# EAGLE design woodenHaptics_v_0_1 (EAGLE 6.5.0)
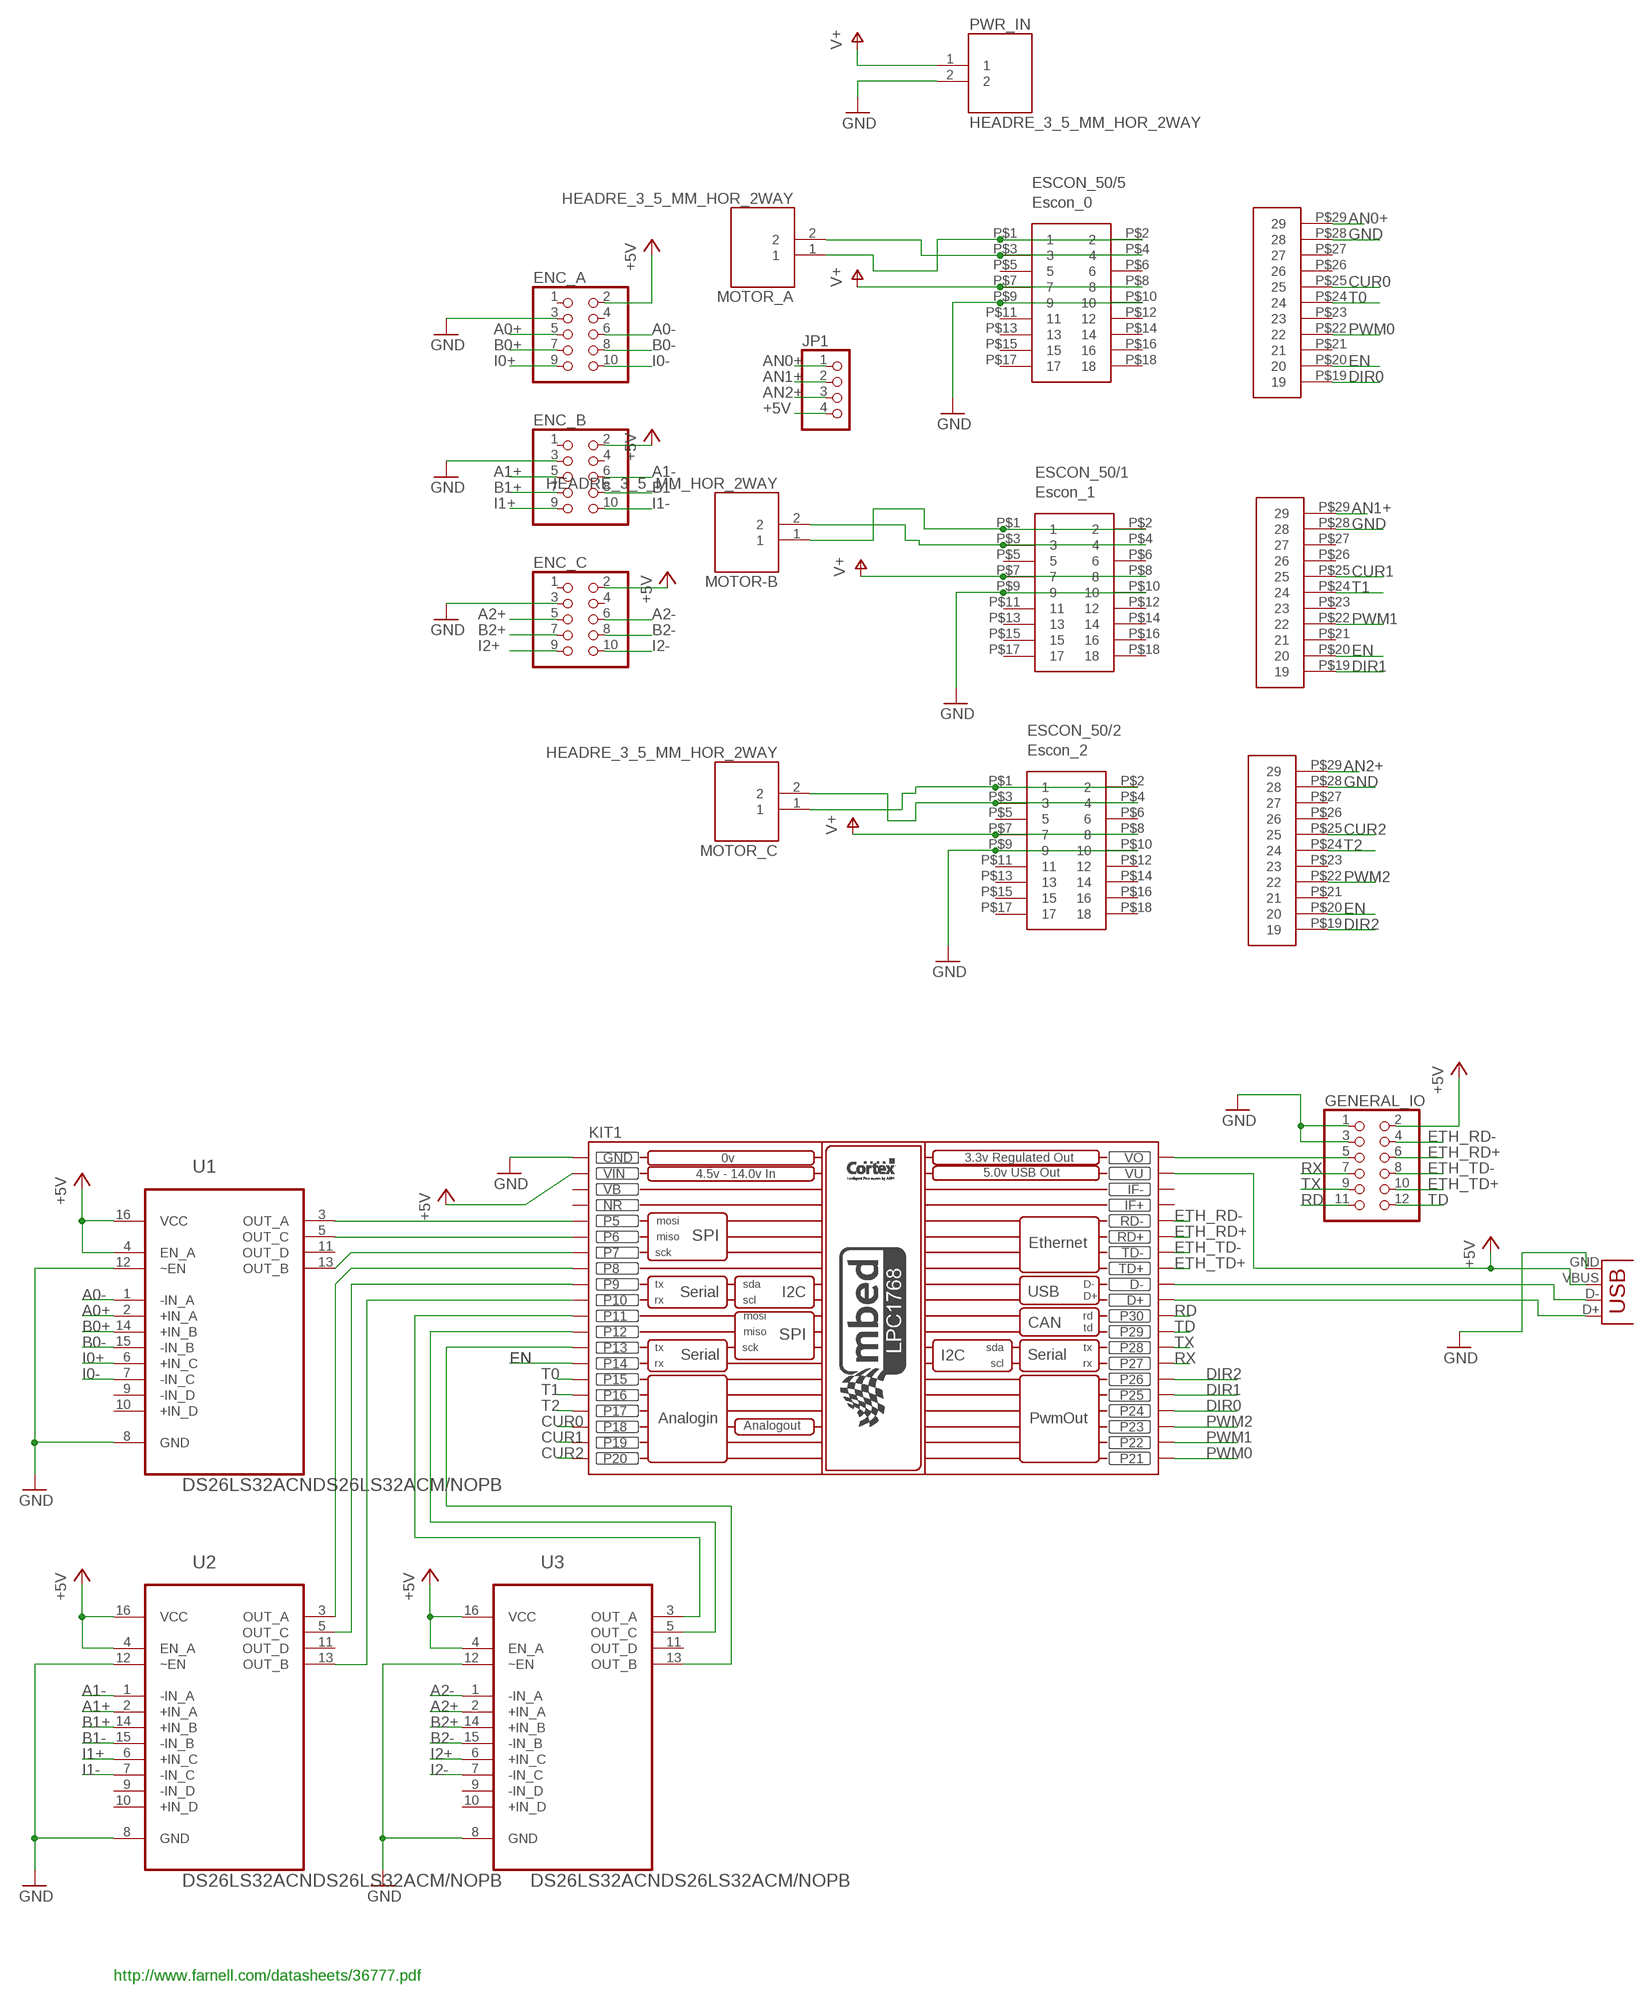
[diagram p0: schematic, sheet 1]

## Parts
ENC_A  PINHD-2X5  [2X05]
ENC_B  PINHD-2X5  [2X05]
ENC_C  PINHD-2X5  [2X05]
ESCON_50/1  Escon_1  ESCON_MODULE_50/5  [MODULE]
ESCON_50/2  Escon_2  ESCON_MODULE_50/5  [MODULE]
ESCON_50/5  Escon_0  ESCON_MODULE_50/5  [MODULE]
GENERAL_IO  PINHD-2X6  [2X06]
JP1  PINHD-1X4  [1X04]
KIT1  MBED_NXP_LPC1768  [MBED-KIT]
MOTOR-B  HEADRE_3_5_MM_HOR_2WAY  [HEADER_3_5MM_HOR_2WAY]
MOTOR_A  HEADRE_3_5_MM_HOR_2WAY  [HEADER_3_5MM_HOR_2WAY]
MOTOR_C  HEADRE_3_5_MM_HOR_2WAY  [HEADER_3_5MM_HOR_2WAY]
PWR_IN  HEADRE_3_5_MM_HOR_2WAY  [HEADER_3_5MM_HOR_2WAY]
U1  DS26LS32ACNDS26LS32ACM/NOPB  [M16]
U2  DS26LS32ACNDS26LS32ACM/NOPB  [M16]
U3  DS26LS32ACNDS26LS32ACM/NOPB  [M16]
X2  Micro USB  USB-MICROB  [USB-MICROB]

## Nets
+5V: ENC_A.2 ENC_B.2 ENC_C.2 GENERAL_IO.2 JP1.4 KIT1.VIN KIT1.VU U1.4(EN_A) U1.16(VCC) U2.4(EN_A) U2.16(VCC) U3.4(EN_A) U3.16(VCC) X2.VBUS
A0+: ENC_A.5 U1.2(+IN_A)
A0-: ENC_A.6 U1.1(-IN_A)
A1+: ENC_B.5 U2.2(+IN_A)
A1-: ENC_B.6 U2.1(-IN_A)
A2+: ENC_C.5 U3.2(+IN_A)
A2-: ENC_C.6 U3.1(-IN_A)
AN0+: ESCON_50/5.P$29 JP1.1
AN1+: ESCON_50/1.P$29 JP1.2
AN2+: ESCON_50/2.P$29 JP1.3
B0+: ENC_A.7 U1.14(+IN_B)
B0-: ENC_A.8 U1.15(-IN_B)
B1+: ENC_B.7 U2.14(+IN_B)
B1-: ENC_B.8 U2.15(-IN_B)
B2+: ENC_C.7 U3.14(+IN_B)
B2-: ENC_C.8 U3.15(-IN_B)
CUR0: ESCON_50/5.P$25 KIT1.P$18(P18)
CUR1: ESCON_50/1.P$25 KIT1.P$19(P19)
CUR2: ESCON_50/2.P$25 KIT1.P$20(P20)
DIR0: ESCON_50/5.P$19 KIT1.P$24(P24)
DIR1: ESCON_50/1.P$19 KIT1.P$25(P25)
DIR2: ESCON_50/2.P$19 KIT1.P$26(P26)
EN: ESCON_50/1.P$20 ESCON_50/2.P$20 ESCON_50/5.P$20 KIT1.P$14(P14)
ETH_RD+: GENERAL_IO.6 KIT1.RD+
ETH_RD-: GENERAL_IO.4 KIT1.RD-
ETH_TD+: GENERAL_IO.10 KIT1.TD+
ETH_TD-: GENERAL_IO.8 KIT1.TD-
GND: ENC_A.3 ENC_B.3 ENC_C.3 ESCON_50/1.P$9 ESCON_50/1.P$10 ESCON_50/1.P$28 ESCON_50/2.P$9 ESCON_50/2.P$10 ESCON_50/2.P$28 ESCON_50/5.P$9 ESCON_50/5.P$10 ESCON_50/5.P$28 GENERAL_IO.1 GENERAL_IO.3 KIT1.GND PWR_IN.2 U1.8(GND) U1.12(~EN) U2.8(GND) U2.12(~EN) U3.8(GND) U3.12(~EN) X2.GND
I0+: ENC_A.9 U1.6(+IN_C)
I0-: ENC_A.10 U1.7(-IN_C)
I1+: ENC_B.9 U2.6(+IN_C)
I1-: ENC_B.10 U2.7(-IN_C)
I2+: ENC_C.9 U3.6(+IN_C)
I2-: ENC_C.10 U3.7(-IN_C)
N$1: ESCON_50/5.P$3 ESCON_50/5.P$4 MOTOR_A.2
N$2: ESCON_50/1.P$1 ESCON_50/1.P$2 MOTOR-B.1
N$3: KIT1.D- X2.D-
N$4: ESCON_50/1.P$3 ESCON_50/1.P$4 MOTOR-B.2
N$5: ESCON_50/2.P$1 ESCON_50/2.P$2 MOTOR_C.1
N$6: ESCON_50/2.P$3 ESCON_50/2.P$4 MOTOR_C.2
N$7: KIT1.D+ X2.D+
N$9: KIT1.P$8(P8) U2.3(OUT_A)
N$10: GENERAL_IO.5 KIT1.VOUT(VO)
N$11: KIT1.P$5(P5) U1.3(OUT_A)
N$12: KIT1.P$6(P6) U1.5(OUT_C)
N$13: KIT1.P$7(P7) U1.13(OUT_B)
N$14: KIT1.P$9(P9) U2.5(OUT_C)
N$15: KIT1.P$10(P10) U2.13(OUT_B)
N$16: KIT1.P$11(P11) U3.3(OUT_A)
N$17: KIT1.P$12(P12) U3.5(OUT_C)
N$18: KIT1.P$13(P13) U3.13(OUT_B)
N$19: ESCON_50/5.P$1 ESCON_50/5.P$2 MOTOR_A.1
PWM0: ESCON_50/5.P$22 KIT1.P$21(P21)
PWM1: ESCON_50/1.P$22 KIT1.P$22(P22)
PWM2: ESCON_50/2.P$22 KIT1.P$23(P23)
RD: GENERAL_IO.11 KIT1.P$30(P30)
RX: GENERAL_IO.7 KIT1.P$27(P27)
T0: ESCON_50/5.P$24 KIT1.P$15(P15)
T1: ESCON_50/1.P$24 KIT1.P$16(P16)
T2: ESCON_50/2.P$24 KIT1.P$17(P17)
TD: GENERAL_IO.12 KIT1.P$29(P29)
TX: GENERAL_IO.9 KIT1.P$28(P28)
V+: ESCON_50/1.P$7 ESCON_50/1.P$8 ESCON_50/2.P$7 ESCON_50/2.P$8 ESCON_50/5.P$7 ESCON_50/5.P$8 PWR_IN.1
Unconnected: ENC_A.1 ENC_A.4 ENC_B.1 ENC_B.4 ENC_C.1 ENC_C.4 ESCON_50/1.P$5 ESCON_50/1.P$6 ESCON_50/1.P$11 ESCON_50/1.P$12 ESCON_50/1.P$13 ESCON_50/1.P$14 ESCON_50/1.P$15 ESCON_50/1.P$16 ESCON_50/1.P$17 ESCON_50/1.P$18 ESCON_50/1.P$21 ESCON_50/1.P$23 ESCON_50/1.P$26 ESCON_50/1.P$27 ESCON_50/2.P$5 ESCON_50/2.P$6 ESCON_50/2.P$11 ESCON_50/2.P$12 ESCON_50/2.P$13 ESCON_50/2.P$14 ESCON_50/2.P$15 ESCON_50/2.P$16 ESCON_50/2.P$17 ESCON_50/2.P$18 ESCON_50/2.P$21 ESCON_50/2.P$23 ESCON_50/2.P$26 ESCON_50/2.P$27 ESCON_50/5.P$5 ESCON_50/5.P$6 ESCON_50/5.P$11 ESCON_50/5.P$12 ESCON_50/5.P$13 ESCON_50/5.P$14 ESCON_50/5.P$15 ESCON_50/5.P$16 ESCON_50/5.P$17 ESCON_50/5.P$18 ESCON_50/5.P$21 ESCON_50/5.P$23 ESCON_50/5.P$26 ESCON_50/5.P$27 KIT1.IF+ KIT1.IF- U1.9(-IN_D) U1.10(+IN_D) U1.11(OUT_D) U2.9(-IN_D) U2.10(+IN_D) U2.11(OUT_D) U3.9(-IN_D) U3.10(+IN_D) U3.11(OUT_D)

## Notes on the sheet
- http://www.farnell.com/datasheets/36777.pdf

## Power pins joined to a net without a drawn wire
NR: KIT1.NR
VB: KIT1.VB

## Library data of the parts
ENC_A ENC_B ENC_C = pinhead:PINHD-2X5: PIN HEADER
ESCON_50/1 ESCON_50/2 ESCON_50/5 = Maxon-Motor:ESCON_MODULE_50/5
GENERAL_IO = pinhead:PINHD-2X6: PIN HEADER
JP1 = pinhead:PINHD-1X4: PIN HEADER
KIT1 = MBED_v2.1:MBED_NXP_LPC1768: Mbed LPC1768 - ARM CORTEX v2.1 * Schematic symbol is now placed in eagles's default raster. *The pads diameter are suitable for routing between mbed pins * mbed pads are 0.8 mm drill diameter. --------------------------------------------- Created by: Mohamed Yousry *Alexandria, Egypt *Email: mohamed.yousry@ieeegoldegypt.org
MOTOR-B MOTOR_A MOTOR_C PWR_IN = header_3_5_MM_HOR_2WAY:HEADRE_3_5_MM_HOR_2WAY
U1-U3 = DSL26LS32ACN:DS26LS32ACN: Receiver
X2 = SparkFun:USB: USB Connectors USB-B-PTH is fully proven SKU : PRT-00139 USB-miniB is fully proven SKU : PRT-00587 USB-A-PCB is untested. USB-A-H is throughly reviewed, but untested. Spark Fun Electronics SKU : PRT-00437 USB-B-SMT is throughly reviewed, but untested. Needs silkscreen touching up. USB-A-S has not been used/tested USB-MB-H has not been used/tested

## Board
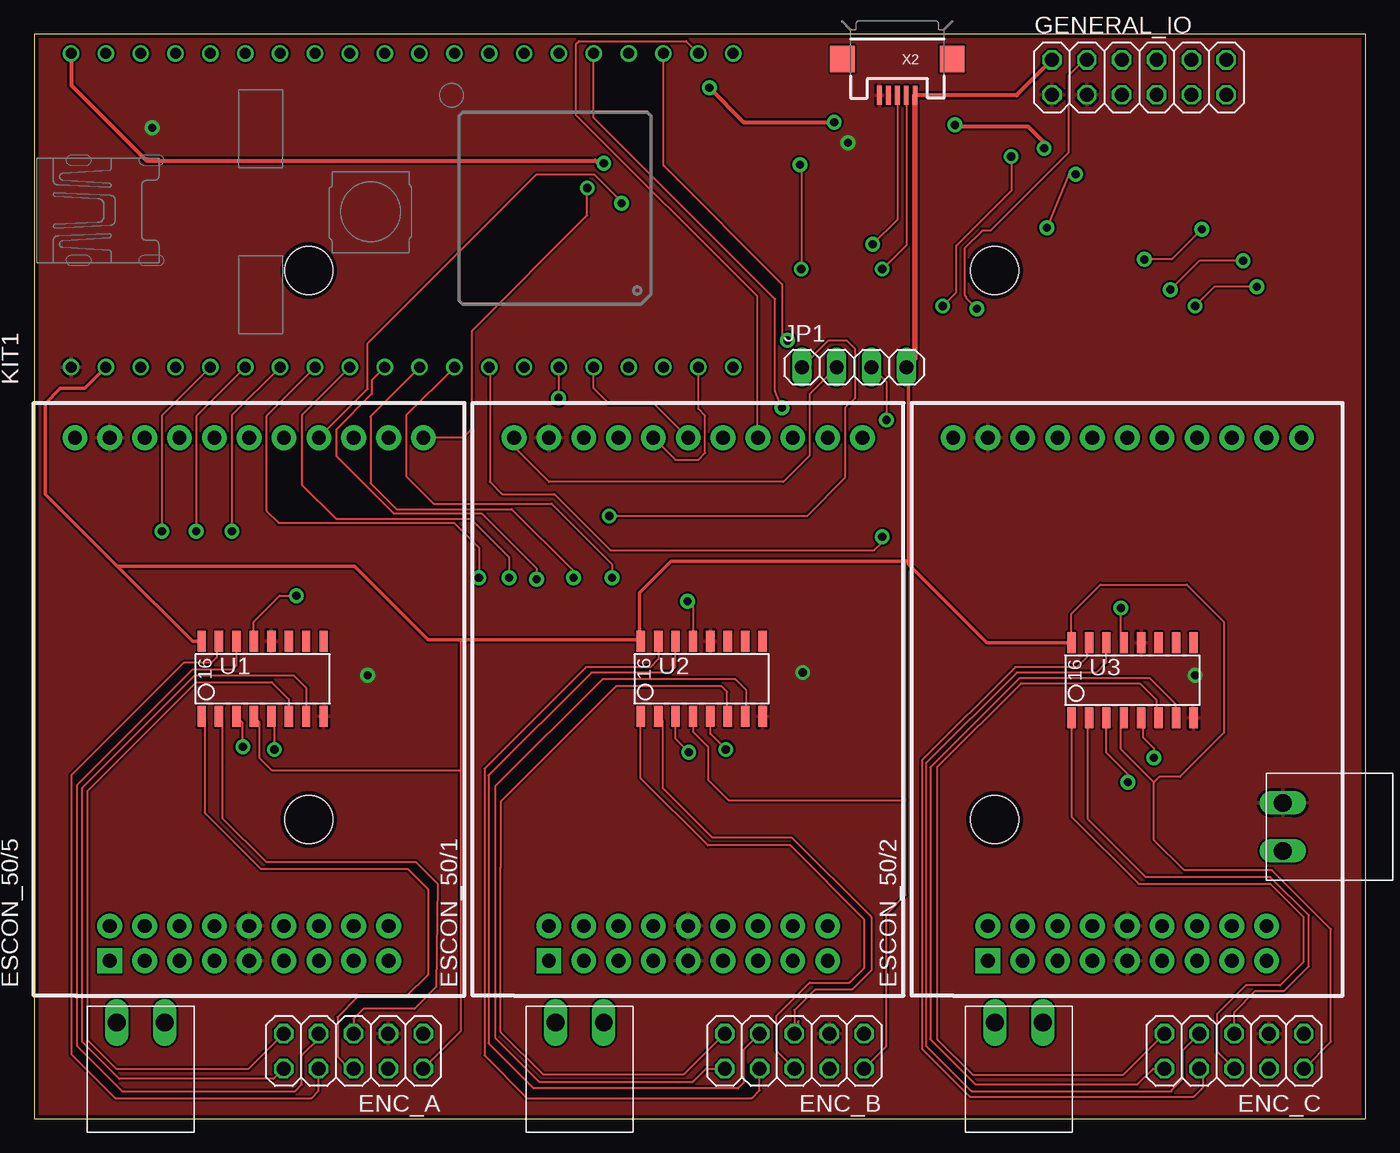
[diagram p1: board, top side]
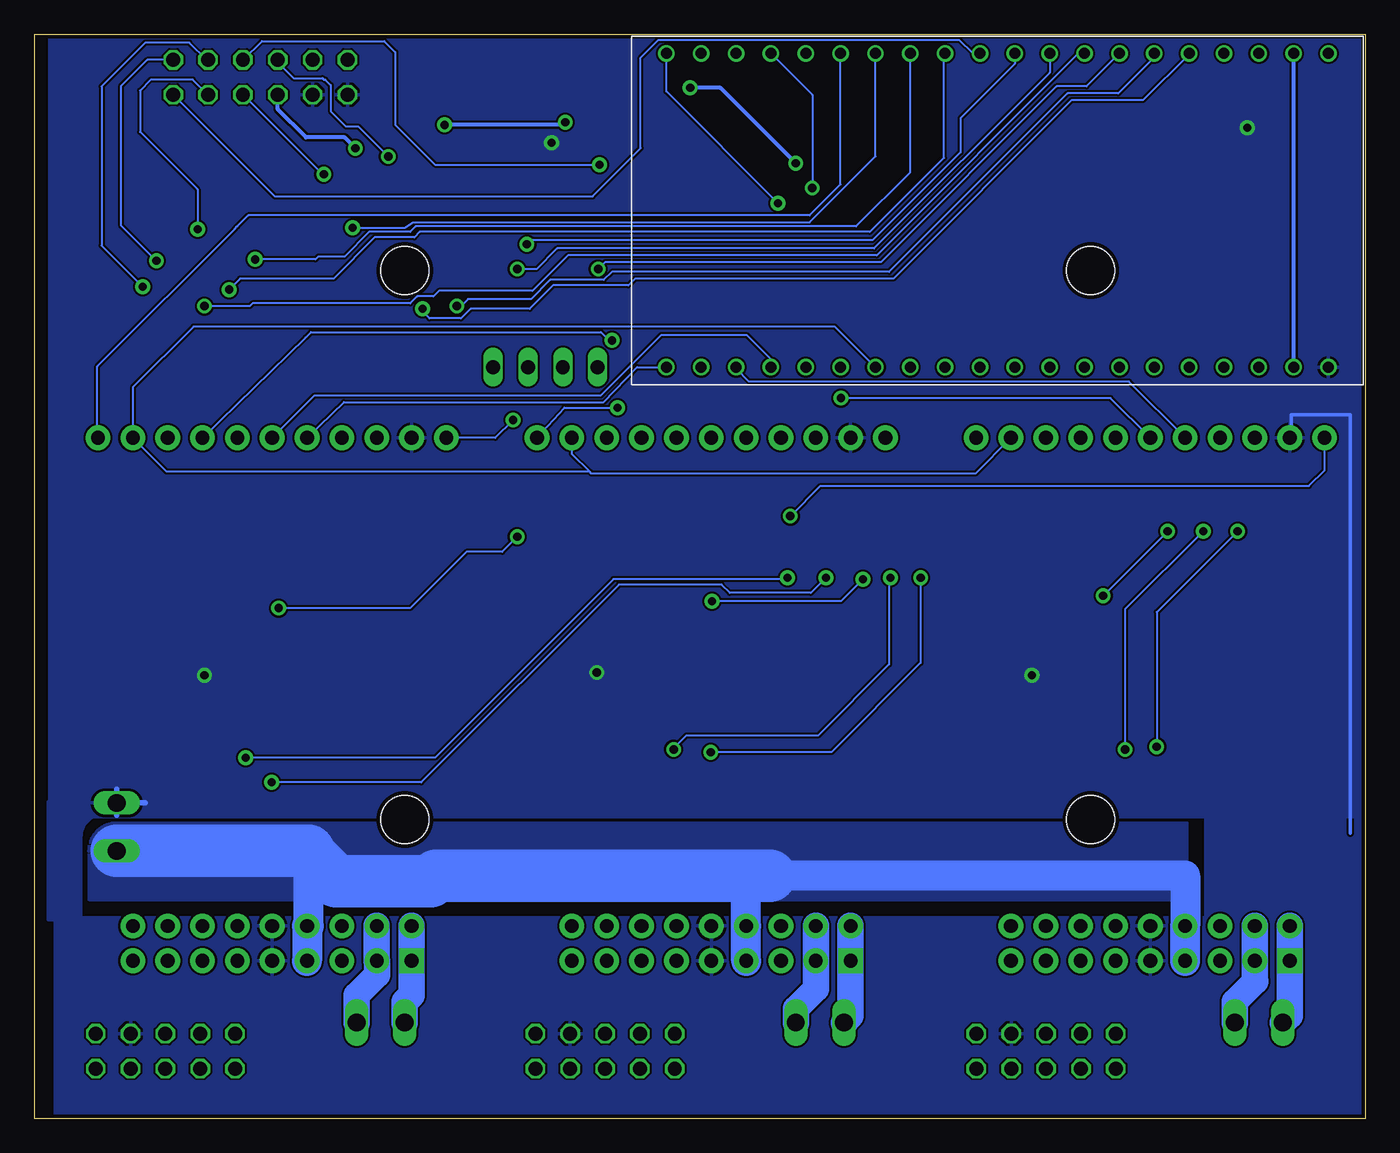
[diagram p2: board, bottom side, seen from below]

Size 97 x 79 mm. Coordinates in mm from the lower left corner, seen from the top.
Outline: 0,0 97,0 97,79 0,79 0,0
Copper layers (1*16): Top 0.035mm / dielectric 1.5mm / Bottom 0.035mm
Design rules "PCB-POOL Standard": minimum track width 0.15mm, minimum drill 0.3mm, track to track 0.15mm, track to pad 0.15mm, pad to pad 0.15mm, via to via 0.15mm, smd to smd 0.15mm, copper to edge 0.3mm, drill to drill 0.2mm, minimum pad ring 0.2mm, minimum via ring 0.15mm, stop-mask expansion 0.075mm, vias tented up to drill 0mil, thermal gap 0.2mm
Holes 3.5 mm at 20,21.8 20,61.8 70,21.8 70,61.8

### Footprints (pad centres in the part's own frame; a part is rotated, then mirrored left to right if it is on the bottom)
2X05 = drill 1.016 octagon: 1 -5.08,-1.27; 2 -5.08,1.27; 3 -2.54,-1.27; 4 -2.54,1.27; 5 0,-1.27; 6 0,1.27; 7 2.54,-1.27; 8 2.54,1.27; 9 5.08,-1.27; 10 5.08,1.27
MODULE = drill 1 pad 1.8 square: P$1 0,0 | drill 1 pad 1.8: P$2 2.54,0; P$3 0,-2.54; P$4 2.54,-2.54; P$5 0,-5.08; P$6 2.54,-5.08; P$7 0,-7.62; P$8 2.54,-7.62; P$9 0,-10.16; P$10 2.54,-10.16; P$11 0,-12.7; P$12 2.54,-12.7; P$13 0,-15.24; P$14 2.54,-15.24; P$15 0,-17.78; P$16 2.54,-17.78; P$17 0,-20.32; P$18 2.54,-20.32; P$19 38.1,-22.86; P$20 38.1,-20.32; P$21 38.1,-17.78; P$22 38.1,-15.24; P$23 38.1,-12.7; P$24 38.1,-10.16; P$25 38.1,-7.62; P$26 38.1,-5.08; P$27 38.1,-2.54; P$28 38.1,0; P$29 38.1,2.54
2X06 = drill 1.016 octagon: 1 -6.35,-1.27; 2 -6.35,1.27; 3 -3.81,-1.27; 4 -3.81,1.27; 5 -1.27,-1.27; 6 -1.27,1.27; 7 1.27,-1.27; 8 1.27,1.27; 9 3.81,-1.27; 10 3.81,1.27; 11 6.35,-1.27; 12 6.35,1.27
1X04 = drill 1.016 long: 1 -3.81,0; 2 -1.27,0; 3 1.27,0; 4 3.81,0
MBED-KIT = drill 0.8: D+ 11.43,1.27; D- 11.43,3.81; GND -11.43,24.13; IF+ 11.43,16.51; IF- 11.43,19.05; NR -11.43,16.51; P$5 -11.43,13.97; P$6 -11.43,11.43; P$7 -11.43,8.89; P$8 -11.43,6.35; P$9 -11.43,3.81; P$10 -11.43,1.27; P$11 -11.43,-1.27; P$12 -11.43,-3.81; P$13 -11.43,-6.35; P$14 -11.43,-8.89; P$15 -11.43,-11.43; P$16 -11.43,-13.97; P$17 -11.43,-16.51; P$18 -11.43,-19.05; P$19 -11.43,-21.59; P$20 -11.43,-24.13; P$21 11.43,-24.13; P$22 11.43,-21.59; P$23 11.43,-19.05; P$24 11.43,-16.51; P$25 11.43,-13.97; P$26 11.43,-11.43; P$27 11.43,-8.89; P$28 11.43,-6.35; P$29 11.43,-3.81; P$30 11.43,-1.27; RD+ 11.43,11.43; RD- 11.43,13.97; TD+ 11.43,6.35; TD- 11.43,8.89; VB -11.43,19.05; VIN -11.43,21.59; VOUT 11.43,24.13; VU 11.43,21.59
HEADER_3_5MM_HOR_2WAY = drill 1.3 long: 1 0,0; 2 3.5,0
M16 = smd 0.61 x 1.524: 1 -1.905,-2.794; 2 -0.635,-2.794; 3 0.635,-2.794; 4 1.905,-2.794; 5 3.175,-2.794; 6 4.445,-2.794; 7 5.715,-2.794; 8 6.985,-2.794; 9 6.985,2.667; 10 5.715,2.667; 11 4.445,2.667; 12 3.175,2.667; 13 1.905,2.667; 14 0.635,2.667; 15 -0.635,2.667; 16 -1.905,2.667
USB-MICROB = smd 0.35 x 1.4: D+ 0,2.65; D- -0.65,2.65; GND 1.3,2.65; ID 0.65,2.65; VBUS -1.3,2.65 | smd 1.8 x 1.9: MT1 -4,0; MT2 4,0

### Placement (x,y rotation side)
ENC_A  23.26,4.92 180 top
ENC_B  55.4,4.92 180 top
ENC_C  87.44,4.92 180 top
ESCON_50/1  37.5,11.5 90 top
ESCON_50/2  69.5,11.5 90 top
ESCON_50/5  5.5,11.5 90 top
GENERAL_IO  80.53,75.86 0 top
JP1  59.75,54.75 0 top
KIT1  26.8,66.17 90 top
MOTOR-B  38,7 0 top
MOTOR_A  6,7 0 top
MOTOR_C  70,7 0 top
PWR_IN  91,19.5 90 top
U1  14.1,32.1 0 top
U2  46.1,32.1 0 top
U3  77.5,32 0 top
X2  62.9,77.2 180 top

### Tracks (layer width: path | path; a pad name or v marks a point on that pad's centre or on a via)
+5V
  Top 0.15: ENC_A.2 31.1,6.41 31.1,25.4 | 31.1,25.4 31.1,34.9 | U1.4 16.4,28.91 16.4,26.3 17.3,25.4 31.1,25.4 | ENC_B.2 62.1,5.27 62.1,14.9 63.5,16.3 63.5,23.2 | 63.5,23.2 63.5,40.6 | U2.4 48,28.2 49.1,27.1 49.1,24.7 50.6,23.2 63.5,23.2 | ENC_C.2 92.55,3.65 94.5,5.6 94.5,13.8 90.2,18.1 83.8,18.1 81.6,20.3 81.6,24.5 | 81.6,24.5 79.2,26.9 79.2,29 U3.4 | U3.16 75.59,36.8 77.7,38.9 84,38.9 86.7,36.2 86.7,28.1 83.5,24.9 82,24.9 81.6,24.5
  Top 0.254: JP1.4 63.7,54.61 63.7,40.6 | 63.7,40.6 63.7,40.4 69.43,34.67 U3.16 | U2.16 44.1,34.86 | 44.1,34.86 44.1,38.3 46.4,40.6 63.5,40.6 63.7,40.6 | 6.05,40.25 0.8,45.5 0.8,52.1 1.9,53.2 3.67,53.2 KIT1.VIN | 6.05,40.25 11.53,34.77 U1.16 | 44.1,34.86 44.06,34.9 31.1,34.9 28.7,34.9 23.35,40.25 6.05,40.25
  Top 0.305: GENERAL_IO.2 71.59,74.55 X2.VBUS
  Top 0.406: X2.VBUS 64.2,55.39 JP1.4
  Bottom 0.305: KIT1.VIN KIT1.VU
A0+
  Top 0.15: U1.2 13.7,29.07 13.7,21.9 16.9,18.7 27.8,18.7 29.4,17.1 29.3,9.6 27.7,8 24,8 23.26,7.26 ENC_A.5
A0-
  Top 0.15: U1.1 12.4,29.1 12.4,22.3 16.5,18.2 27.2,18.2 28.7,16.7 28.7,10.5 27.1,8.9 23.6,8.9 22.1,7.4 22.1,4.5 22.95,3.65 ENC_A.6
A1+
  Top 0.15: 55.7,7.1 55.7,6.49 ENC_B.5 55.4,7.9 56.9,9.4 59.6,9.4 61,10.8 61,14.7 55.2,20.5 49.4,20.5 45.8,24.1 45.8,28.97 U2.2
A1-
  Top 0.15: ENC_B.6 54.1,4.95 54.1,7.5 56.5,9.9 59.4,9.9 60.5,11 60.5,14.5 55.1,19.9 49.1,19.9 44.2,24.8 U2.1
A2+
  Top 0.15: ENC_C.5 87.44,7.75 89,9.3 91.1,9.3 92.9,11.1 92.9,14.8 90.1,17.6 81,17.6 76.8,21.8 76.8,29.14 U3.2
A2-
  Top 0.15: U3.1 75.59,22 80.5,17.1 90.1,17.1 92.5,14.7 92.5,11.4 90.8,9.7 88.3,9.7 86.2,7.6 86.2,4.8 86.3,4.8 ENC_C.6
AN0+  (via drill 0.6)
  Top 0.15: JP1.1 57.89,56.7 59.2,56.7 59.8,56.1 59.8,52.5 59.1,51.8 59.1,46.7 56.3,43.9 v41.9,43.9
  Bottom 0.15: v41.9,43.9 39.7,46.1 4.1,46.1 2.96,47.24 ESCON_50/5.P$29
AN1+
  Top 0.15: ESCON_50/1.P$29 34.96,48.94 37.5,46.4 54.6,46.4 56.5,48.3 56.5,52.77 JP1.2
AN2+  (via drill 0.6)
  Top 0.15: JP1.3 62.1,53.67 v62.1,50.9
  Bottom 0.15: v62.1,50.9 63.4,49.6 ESCON_50/2.P$29
B0+
  Top 0.15: U1.14 14.8,34.7 14.8,34.6 14.7,34.5 14.7,33 14.4,32.7 11.5,32.7 3.1,24.3 3.1,5.3 6.4,2 19,2 19.5,2.5 19.5,4.6 20.72,5.82 ENC_A.7
B0-
  Top 0.15: U1.15 13.3,34.6 13.3,33.6 12.9,33.2 10.9,33.2 2.7,25 2.7,4.7 5.9,1.5 20.2,1.5 20.72,2.02 ENC_A.8
B1+
  Top 0.15: U2.14 46.7,34.73 46.7,32.9 46.3,32.5 40.6,32.5 33.1,25 33.1,5.5 36.4,2.2 51.3,2.2 51.7,2.6 51.7,5.03 ENC_B.7
B1-
  Top 0.15: U2.15 45.5,34.73 45.5,33.5 44.9,32.9 40.2,32.9 32.8,25.5 32.8,4.6 35.9,1.5 52.3,1.5 52.86,2.06 ENC_B.8
B2+
  Top 0.15: U3.14 78.2,34.6 78.2,34.2 78.1,34.1 78.1,33.2 77.4,32.5 71.6,32.5 65,25.9 65,5.3 68.3,2 82.9,2 82.9,2.1 83.7,2.9 83.7,4.98 ENC_C.7
B2-
  Top 0.15: U3.15 76.7,34.5 76.7,33.6 76,32.9 71.5,32.9 64.7,26.1 64.7,5.1 68.2,1.6 84.5,1.6 85.2,2.3 85.2,3.35 ENC_C.8
CUR0
  Bottom 0.15: ESCON_50/5.P$25 17.22,53.7 44.9,53.7 45.85,54.66 KIT1.P$18
CUR1
  Top 0.15: ESCON_50/1.P$25 46.72,48 48.4,48 48.9,48.5 48.9,51.2 48.4,51.7 KIT1.P$19
CUR2
  Bottom 0.15: ESCON_50/2.P$25 74.42,52.2 55.5,52.2 53.05,54.74 KIT1.P$20
DIR0  (via drill 0.6)
  Top 0.15: v40.3,67.8 40.3,65.8 31.9,57.4 31.9,50.3 31.3,49.6 ESCON_50/5.P$19
  Bottom 0.15: KIT1.P$24 40.3,74.59 v40.3,67.8
DIR1  (via drill 0.6)
  Top 0.15: v54.5,51.8 54,53 54,59.7 40.77,72.92 KIT1.P$25
  Bottom 0.15: ESCON_50/1.P$19 58.36,51.8 v54.5,51.8
DIR2
  Bottom 0.15: ESCON_50/2.P$19 92.4,49.64 92.4,54.8 82.4,64.8 82.2,65 81.4,65.8 40.5,65.8 38.23,68.06 KIT1.P$26
EN
  Bottom 0.15: ESCON_50/5.P$20 28.42,47 56.4,47 56.55,47.15 | 56.55,47.15 57.82,48.42 ESCON_50/1.P$20 | 56.55,47.15 87.37,47.15 ESCON_50/2.P$20 89.82,53.28 85.4,57.7 38.65,57.7 KIT1.P$14
ETH_RD+  (via drill 0.6)
  Top 0.15: v71.2,70.1 71.2,67.6 67.2,63.6 67.2,60.2 v66.2,59.2
  Bottom 0.15: GENERAL_IO.6 79.25,76.95 78.1,75.8 76,75.8 75.9,75.7 75.8,75.7 75.4,75.3 75.4,73.4 74.3,72.3 73.4,72.3 v71.2,70.1 | KIT1.RD+ 15.38,77.33 18,74.7 21.7,74.7 34.7,61.7 54.9,61.7 55.5,61.1 59.4,61.1 60.8,59.7 65.4,59.7 65.9,59.2 v66.2,59.2
ETH_RD-  (via drill 0.6)
  Top 0.15: GENERAL_IO.4 76.53,77.14 75.4,76 75.4,70.4 69.7,64.7 69.1,64.7 67.8,63.4 67.8,60 67.9,59.9 67.9,59.8 v68.7,59
  Bottom 0.15: KIT1.RD- 12.84,77.56 16.2,74.2 21.4,74.2 34.4,61.2 53.2,61.2 53.7,60.7 59.2,60.7 60.9,59 65.2,59 65.9,58.3 68.2,58.3 68.7,58.8 v68.7,59
ETH_TD+  (via drill 0.6)
  Top 0.15: v89.1,60.6 86,60.6 v84.6,59.2
  Bottom 0.15: GENERAL_IO.10 84.44,77.14 85.7,78.4 88.9,78.4 92.1,75.2 92.1,63.6 v89.1,60.6 | KIT1.TD+ 20.89,77.61 35.6,62.9 58.1,62.9 60.7,60.3 67.5,60.3 67.9,59.9 69.1,59.9 69.6,59.4 81.1,59.4 81.3,59.2 v84.6,59.2
ETH_TD-  (via drill 0.6)
  Top 0.15: v55.8,69.5 55.9,69.4 v55.9,61.9
  Bottom 0.15: GENERAL_IO.8 81.77,77.14 80.4,78.5 71.5,78.5 70.7,77.7 70.7,72.4 67.8,69.5 v55.8,69.5 | KIT1.TD- 20.32,75.2 22.5,75.2 35.3,62.4 55.4,62.4 v55.9,61.9
GND  (via drill 0.6)
  Bottom 0.15: 5.4,49.5 ESCON_50/5.P$28
  Bottom 0.254: 5.4,49.5 5.4,51.3 1.1,51.3 1.1,20.8
  Bottom 0.406: 91,24 PWR_IN.2 | PWR_IN.2 91,22.1 | 88.9,23 PWR_IN.2
  other vias: 59.3,71.1 84.6,32.3 56,32.5 24.3,32.3 8.6,72.2
  pour Top: -0.1,79 97.1,79 97.1,0 -0.1,0
  pour Bottom: 95.5,0 95.5,14.7 -0.1,14.7 -0.1,0
  pour Bottom: 0.3,78.7 96,78.7 96,21.9 0.3,21.9
  pour Bottom: 0,13.3 -0.1,22.4 -0.1,13.3
  pour Bottom: 91,23.1 96,23.1 96,23 96,14.5 93.6,14.5 93.6,20.5 arc90 91.9,22.2 91.1,22.2 arc-90 91,22.3
I0+
  Top 0.15: ENC_A.9 15.59,3.6 6,3.6 3.9,5.7 3.9,23.9 11.8,31.8 17.3,31.8 18.55,30.55 U1.6
I0-
  Top 0.15: ENC_A.10 17.43,2.9 6.2,2.9 3.5,5.6 3.5,24.1 11.7,32.3 18.9,32.3 19.82,31.39 U1.7
I1+
  Top 0.15: U2.6 50.5,29.35 50.5,31.1 50.1,31.5 42.4,31.5 34,23.1 34,18.6 34,18.3 34,6.3 37.1,3.2 47.33,3.2 ENC_B.9
I1-
  Top 0.15: U2.7 51.9,29.39 51.9,31.2 51.1,32 41.4,32 33.6,24.2 33.6,5.9 36.8,2.7 48,2.7 48.95,3.65 ENC_B.10
I2+
  Top 0.15: U3.6 81.8,29.35 81.8,30.5 80.6,31.7 71.9,31.7 65.8,25.6 65.8,5.8 68.4,3.2 79.38,3.2 ENC_C.9
I2-
  Top 0.15: U3.7 83.22,30.18 81.3,32.1 71.8,32.1 65.3,25.6 65.3,5.8 68.6,2.5 80.4,2.5 81.55,3.65 ENC_C.10
N$1
  Bottom 1.93: MOTOR_A.2 9.5,8.5 8,10 8.04,10.04 ESCON_50/5.P$3 ESCON_50/5.P$4
N$2
  Bottom 1.93: ESCON_50/1.P$2 ESCON_50/1.P$1 37.5,7.5 MOTOR-B.1
N$3  (via drill 0.6)
  Top 0.15: 62.23,62.34 v61.8,61.9 63.55,63.65 X2.D-
  Bottom 0.15: KIT1.D- 23,76.2 35.8,63.4 58.9,63.4 60.4,61.9 v61.8,61.9
N$4
  Bottom 1.93: ESCON_50/1.P$4 ESCON_50/1.P$3 40.04,9.46 41.5,8 MOTOR-B.2
N$5
  Bottom 1.93: ESCON_50/2.P$2 ESCON_50/2.P$1 69.5,9 70,8.5 MOTOR_C.1
N$6
  Bottom 1.93: MOTOR_C.2 73.5,9 72,10.5 72,11.46 ESCON_50/2.P$3 ESCON_50/2.P$4
N$7  (via drill 0.6)
  Top 0.15: 61.44,64.03 v61.1,63.7 62.9,65.5 X2.D+
  Bottom 0.15: KIT1.D+ 25.54,76.86 29.5,72.9 29.5,70.4 35.9,64 60.8,64 v61.1,63.7
N$8
  pour Bottom: 11.6,22.1 11.6,14.3 0.3,14.3 0.3,22.1
N$9  (via drill 0.6)
  Top 0.15: KIT1.P$8 16.9,51.19 16.9,44.3 17.8,43.4 30.6,43.4 32.4,41.6 v32.4,39.4 | v47.7,26.7 46.73,27.66 U2.3
  Bottom 0.15: v32.4,39.4 32.4,33.2 38.9,26.7 v47.7,26.7
N$10  (via drill 0.6)
  Top 0.305: KIT1.VOUT 2.7,77.61 2.7,75.3 8.2,69.8 40.9,69.8 41.1,69.6 v41.5,69.6 | v49.2,75.1 51.7,72.6 v58.3,72.6 | v67.1,72.4 67.2,72.3 72.4,72.3 73.6,71.1 v73.6,70.7
  Bottom 0.305: v41.5,69.6 47,75.1 v49.2,75.1 | v58.3,72.6 58.5,72.4 v67.1,72.4 | v73.6,70.7 74.4,71.5 77.2,71.5 79.25,73.56 GENERAL_IO.5
N$11  (via drill 0.6)
  Top 0.15: KIT1.P$5 9.3,51.21 v9.3,42.8 | v15.2,27.1 15.2,28.84 U1.3
  Bottom 0.15: v9.3,42.8 15.2,36.9 v15.2,27.1
N$12  (via drill 0.6)
  Top 0.15: KIT1.P$6 11.8,51.17 v11.8,42.8 | v17.5,26.9 17.5,29.08 U1.5
  Bottom 0.15: v11.8,42.8 17.5,37.1 v17.5,26.9
N$13  (via drill 0.6)
  Top 0.15: KIT1.P$7 14.4,51.23 v14.4,42.8 | U1.13 16,36.2 17.9,38.1 v19.1,38.1
  Bottom 0.15: v14.4,42.8 v19.1,38.1
N$14  (via drill 0.6)
  Top 0.15: KIT1.P$9 19.5,51.25 19.5,46.2 22,43.7 31.8,43.7 34.6,40.9 v34.6,39.4 | v50.4,26.9 49.27,28.02 U2.5
  Bottom 0.15: v34.6,39.4 34.7,39.3 34.7,33.1 39.9,27.9 49.5,27.9 50.4,27 v50.4,26.9
N$15  (via drill 0.6)
  Top 0.15: KIT1.P$10 24.6,53.81 24.6,52.8 22,50.2 22,48.3 26.2,44.1 32.6,44.1 36.6,40.1 v36.6,39.3 | v47.6,37.7 48.01,37.3 U2.13
  Bottom 0.15: v36.6,39.3 38.2,37.7 v47.6,37.7
N$16  (via drill 0.6)
  Top 0.15: KIT1.P$11 24.5,51.17 24.5,46.3 26.4,44.4 34.8,44.4 39.3,39.9 v39.3,39.4 | U3.3 78.1,29.17 78.1,26.7 79.7,25.1 v79.7,24.5
  Bottom 0.15: v39.3,39.4 40.4,38.3 46.3,38.3 46.9,38.9 54.4,38.9 68.8,24.5 v79.7,24.5
N$17  (via drill 0.6)
  Top 0.15: KIT1.P$12 27.1,51.23 27.1,46.8 29.1,44.8 37.7,44.8 42.1,40.4 v42.1,39.4 | U3.5 80.8,29.08 80.8,27.8 81.6,27 v81.6,26.3
  Bottom 0.15: v42.1,39.4 42.2,39.3 54.8,39.3 67.8,26.3 v81.6,26.3 81.7,26.3
N$18  (via drill 0.6)
  Top 0.15: KIT1.P$13 33.2,54.7 33.2,46.4 34.1,45.5 37.9,45.5 42,41.4 61.2,41.4 61.8,42 v61.8,42.4 | U3.13 79.2,34.87 v79.2,37.2
  Bottom 0.15: v61.8,42.4 62.9,41.3 65.5,41.3 69.6,37.2 v79.2,37.2
N$19
  Bottom 1.93: MOTOR_A.1 5.5,7.5 ESCON_50/5.P$1 ESCON_50/5.P$2
PWM0  (via drill 0.6)
  Top 0.15: ESCON_50/5.P$22 24.3,53.16 24.3,56.5 36.6,68.8 40.8,68.8 42.8,66.8 v42.8,66.7
  Bottom 0.15: v42.8,66.7 50.94,74.83 KIT1.P$21
PWM1
  Top 0.15: ESCON_50/1.P$22 52.7,49.64 52.7,59.9 39.5,73.1 39.5,78.3 39.7,78.5 47.5,78.5 KIT1.P$22
PWM2  (via drill 0.6)
  Top 0.15: KIT1.P$23 45.85,69.44 54.5,60.8 54.5,57.1 v54.9,56.7
  Bottom 0.15: ESCON_50/2.P$22 77.24,56.9 76.84,57.3 55.7,57.3 55.1,56.7 v54.9,56.7
RD
  Bottom 0.15: GENERAL_IO.11 79.48,67.2 56.3,67.2 52.8,70.7 52.8,77.3 51.5,78.6 29.6,78.6 28.61,77.61 KIT1.P$30
RX  (via drill 0.6)
  Top 0.15: v75.9,68.8 75.4,68.8 v73.8,64.9
  Bottom 0.15: GENERAL_IO.7 76,68.8 v75.9,68.8 | v73.8,64.9 70,64.9 69.4,65.3 40.5,65.3 35.7,70.11 KIT1.P$27
T0  (via drill 0.6)
  Top 0.15: v38.2,52.5 38.23,52.53 KIT1.P$15
  Bottom 0.15: ESCON_50/5.P$24 18.56,52.5 v38.2,52.5
T1
  Top 0.15: ESCON_50/1.P$24 45.16,52.1 41.9,52.1 40.77,53.23 KIT1.P$16
T2
  Bottom 0.15: ESCON_50/2.P$24 76.56,52.7 55.7,52.7 51.3,57.1 45.1,57.1 43.31,55.31 KIT1.P$17
TD  (via drill 0.6)
  Top 0.15: v88.1,62.5 84.9,62.5 v82.8,60.4
  Bottom 0.15: GENERAL_IO.12 88.77,77.14 90.7,75.2 90.7,65.1 v88.1,62.5 | KIT1.P$29 30.7,77.52 30.7,70 36.1,64.6 68.9,64.6 69.3,64.2 72.2,64.2 75.2,61.2 82,61.2 v82.8,60.4 82.4,60.8
TX  (via drill 0.6)
  Top 0.15: v85.1,64.8 82.9,62.6 v80.9,62.6
  Bottom 0.15: GENERAL_IO.9 85.44,75.7 88.5,75.7 89.3,74.9 89.3,71.9 85.1,67.7 v85.1,64.8 | KIT1.P$28 33.16,68.94 37.1,65 69.2,65 69.6,64.6 72.6,64.6 74.4,62.8 76.3,62.8 76.5,62.6 v80.9,62.6
V+
  Bottom 0.305: ESCON_50/2.P$8 77,14.04
  Bottom 2.184: ESCON_50/5.P$7 ESCON_50/5.P$8 13.12,17.7 43.4,17.7 | ESCON_50/1.P$7 ESCON_50/1.P$8 45.12,17.68 45.1,17.7 | ESCON_50/2.P$8 ESCON_50/2.P$7 | 77,14.04 77,19.3 77,19.5
  Bottom 3.81: PWR_IN.1 77,19.5 | 43.4,17.7 45.1,17.7 67.7,17.7 68.1,17.3 75,17.3 77,19.3
  pour Bottom: 93,19.5 46,18 46,19.5
  pour Bottom: 93,19.5 93,16 13,16 13,21.5 13.5,21.5 84,21.5 90.2,21.5 91,21.5 arc-90